# EAGLE schematic IoT_Sight (EAGLE 6.6.0)

## Sheet 1 of 3
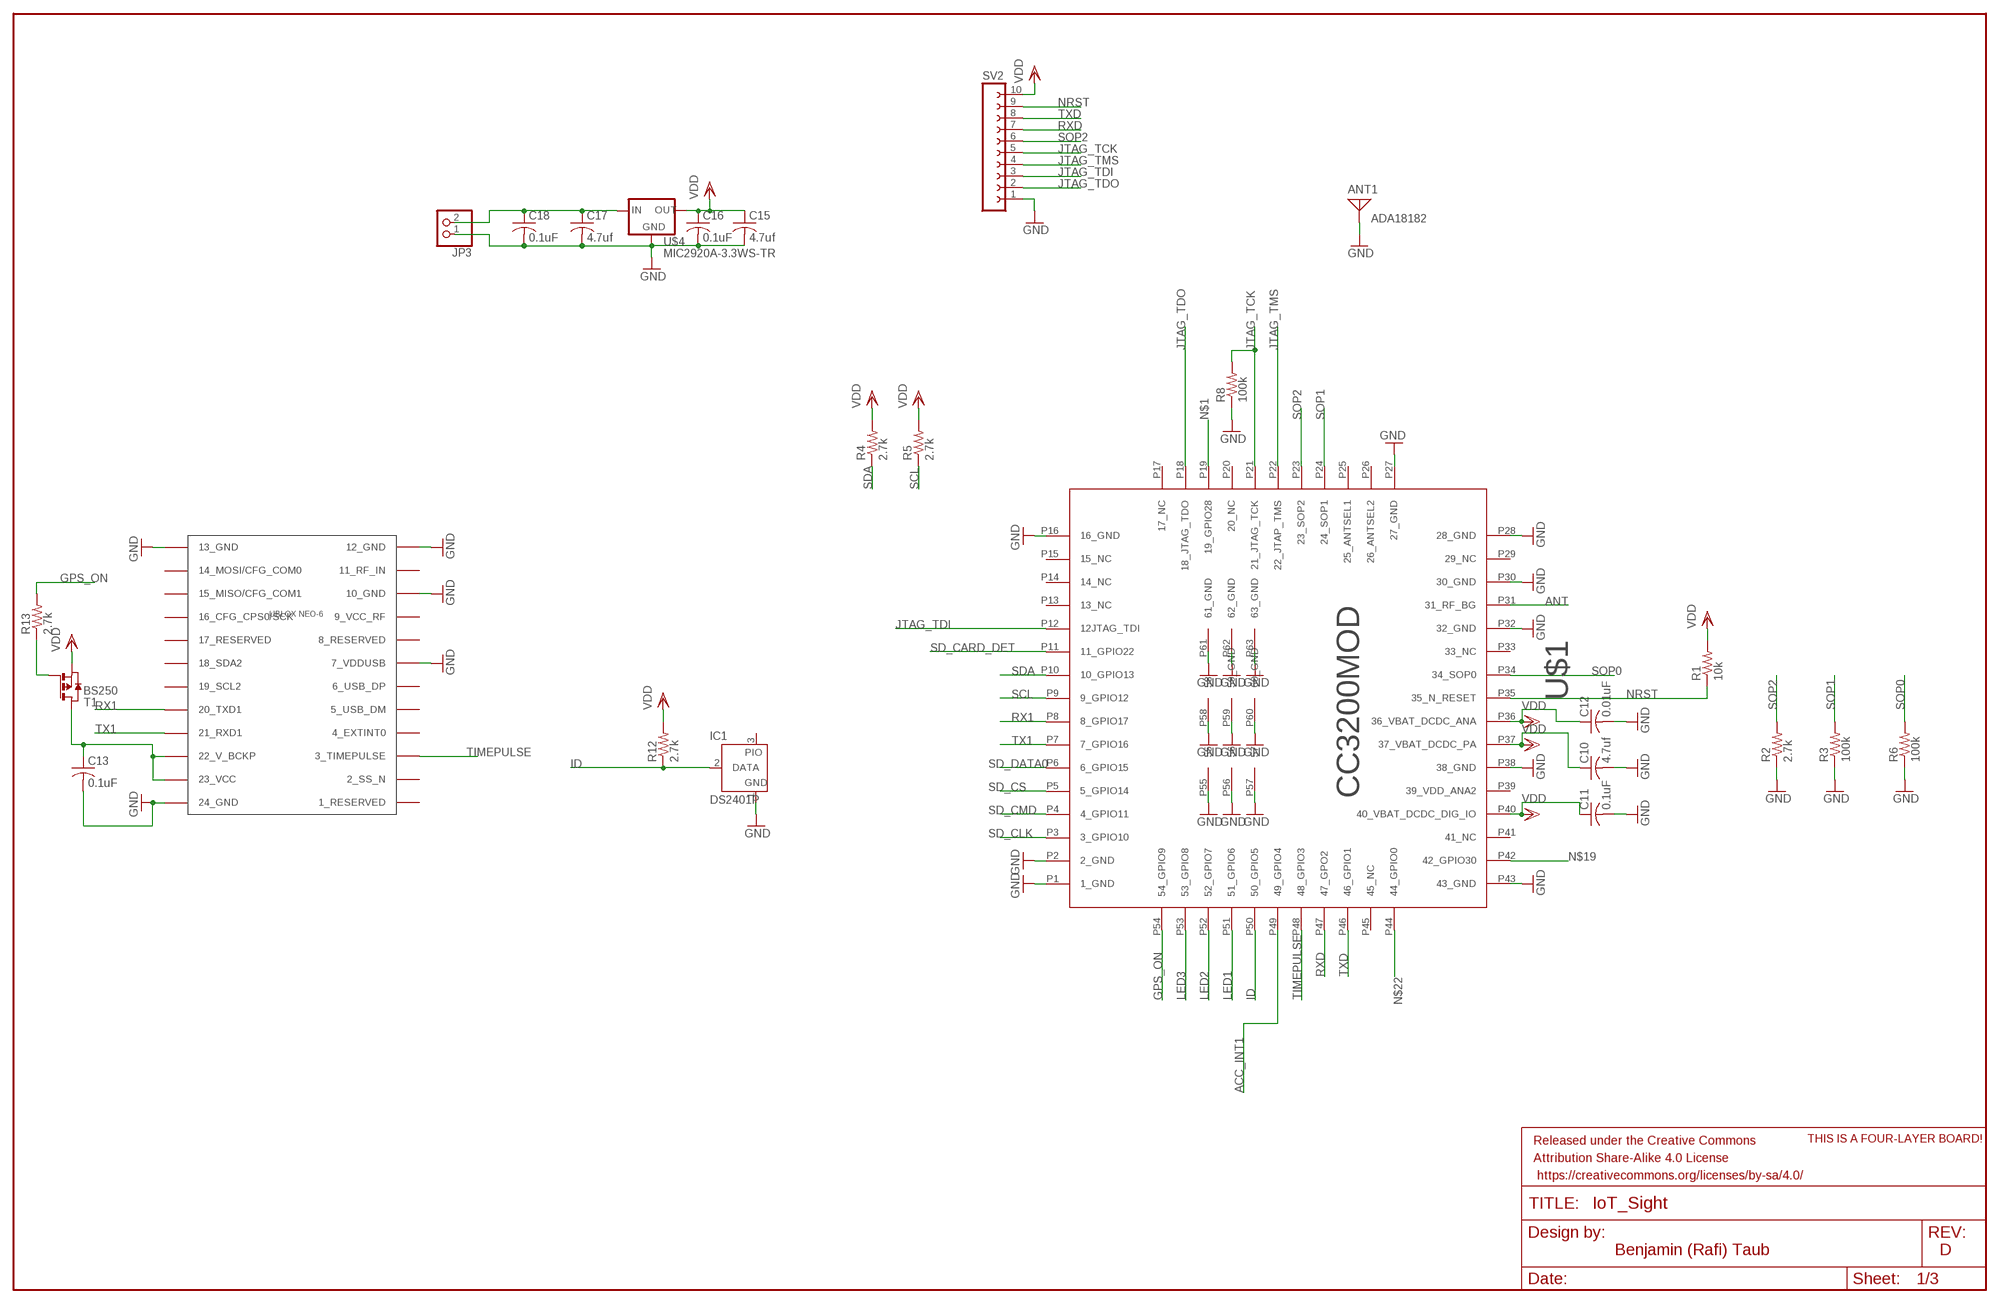
[diagram p0: schematic, sheet 1]

### Parts
ANT1  ADA18182  ANTENNA  [PAD-01]
C10  4.7uf  C-USC0805K  [C0805K]
C11  0.1uF  C-USC0805K  [C0805K]
C12  0.01uF  C-USC0805K  [C0805K]
C13  0.1uF  C-USC0805K  [C0805K]
C15  4.7uf  C-USC0805K  [C0805K]
C16  0.1uF  C-USC0805K  [C0805K]
C17  4.7uf  C-USC0805K  [C0805K]
C18  0.1uF  C-USC0805K  [C0805K]
FRAME1  FRAME-LEDGER  [CREATIVE_COMMONS]
IC1  DS2401P  DS2405P  [TSOC6]
JP3  PINHD-1X2  [1X02]
R1  10k  R-US_R0603  [R0603]
R2  2.7k  R-US_R0603  [R0603]
R3  100k  R-US_R0603  [R0603]
R4  2.7k  R-US_R0603  [R0603]
R5  2.7k  R-US_R0603  [R0603]
R6  100k  R-US_R0603  [R0603]
R8  100k  R-US_R0603  [R0603]
R12  2.7k  R-US_R0603  [R0603]
R13  2.7k  R-US_R0603  [R0603]
SV2  FE10-1  [FE10]
T1  BS250  PMOSSOT23  [SOT-23]
U$1  CC3200MOD  CC3200  [CC3200MOD]
U$2  UBLOX_NEO-7  UBLOX_NEO-6  [UBLOX_NEO-6P]
U$3  FOUR_LAYER_WARNING  [FOUR_LAYER_WARNING]
U$4  MIC2920A-3.3WS-TR  V_REG_MIC2920  [SOT223]

### Nets
ACC_INT1: U$1.P49(49_GPIO4) ; also sheet 2
ANT: U$1.P31(31_RF_BG)
GND: ANT1.1 C10.2 C11.2 C12.2 C13.2 C15.2 C16.2 C17.2 C18.2 IC1.1(GND) JP3.1 R2.1 R3.1 R6.1 R8.1 SV2.1 U$1.P1(1_GND) U$1.P2(2_GND) U$1.P16(16_GND) U$1.P27(27_GND) U$1.P28(28_GND) U$1.P30(30_GND) U$1.P32(32_GND) U$1.P38(38_GND) U$1.P43(43_GND) U$1.P55 U$1.P56 U$1.P57 U$1.P58 U$1.P59(59_GND) U$1.P60(60_GND) U$1.P61(61_GND) U$1.P62(62_GND) U$1.P63(63_GND) U$2.7_VDDUSB U$2.10_GND U$2.12_GND U$2.13_GND U$2.24_GND U$4.2(GND) ; also sheet 2,3
GPS_ON: R13.2 U$1.P54(54_GPIO9)
ID: IC1.2(DATA) R12.1 U$1.P50(50_GPIO5)
JTAG_TCK: R8.2 SV2.5 U$1.P21(21_JTAG_TCK)
JTAG_TDI: SV2.3 U$1.P12(12JTAG_TDI)
JTAG_TDO: SV2.2 U$1.P18(18_JTAG_TDO)
JTAG_TMS: SV2.4 U$1.P22(22_JTAP_TMS)
LED1: U$1.P51(51_GPIO6) ; also sheet 3
LED2: U$1.P52(52_GPIO7) ; also sheet 3
LED3: U$1.P53(53_GPIO8) ; also sheet 3
N$1: U$1.P19(19_GPIO28)
N$17: C17.1 C18.1 JP3.2 U$4.1(IN)
N$18: C13.1 T1.1(D) U$2.22_V_BCKP U$2.23_VCC
N$19: U$1.P42(42_GPIO30)
N$20: R13.1 T1.3(G)
N$22: U$1.P44(44_GPIO0)
NRST: R1.1 SV2.9 U$1.P35(35_N_RESET)
RX1: U$1.P8(8_GPIO17) U$2.20_TXD1
RXD: SV2.7 U$1.P47(47_GPO2)
SCL: R5.1 U$1.P9(9_GPIO12) ; also sheet 2
SD_CARD_DET: U$1.P11(11_GPIO22) ; also sheet 2
SD_CLK: U$1.P3(3_GPIO10) ; also sheet 2
SD_CMD: U$1.P4(4_GPIO11) ; also sheet 2
SD_CS: U$1.P5(5_GPIO14) ; also sheet 2
SD_DATA0: U$1.P6(6_GPIO15) ; also sheet 2
SDA: R4.1 U$1.P10(10_GPIO13) ; also sheet 2
SOP0: R6.2 U$1.P34(34_SOP0)
SOP1: R3.2 U$1.P24(24_SOP1)
SOP2: R2.2 SV2.6 U$1.P23(23_SOP2)
TIMEPULSE: U$1.P48(48_GPIO3) U$2.3_TIMEPULSE
TX1: U$1.P7(7_GPIO16) U$2.21_RXD1
TXD: SV2.8 U$1.P46(46_GPIO1)
VDD: C10.1 C11.1 C12.1 C15.1 C16.1 R1.2 R4.2 R5.2 R12.2 SV2.10 T1.2(S) U$1.P36(36_VBAT_DCDC_ANA) U$1.P37(37_VBAT_DCDC_PA) U$1.P40(40_VBAT_DCDC_DIG_IO) U$4.3(OUT) ; also sheet 2
Unconnected: IC1.3(PIO) U$1.P13(13_NC) U$1.P14(14_NC) U$1.P15(15_NC) U$1.P17(17_NC) U$1.P20(20_NC) U$1.P25(25_ANTSEL1) U$1.P26(26_ANTSEL2) U$1.P29(29_NC) U$1.P33(33_NC) U$1.P39(39_VDD_ANA2) U$1.P41(41_NC) U$1.P45(45_NC) U$2.1_RESERVED U$2.2_SS_N U$2.4_EXTINT0 U$2.5_USB_DM U$2.6_USB_DP U$2.8_RESERVED U$2.9_VCC_RF U$2.11_RF_IN U$2.14_MOSI/CFG_COM0 U$2.15_MISO/CFG_COM1 U$2.16_CFG_CPS0/SCK U$2.17_RESERVED U$2.18_SDA2 U$2.19_SCL2

### Notes on the sheet
- Benjamin (Rafi) Taub | D

## Sheet 2 of 3
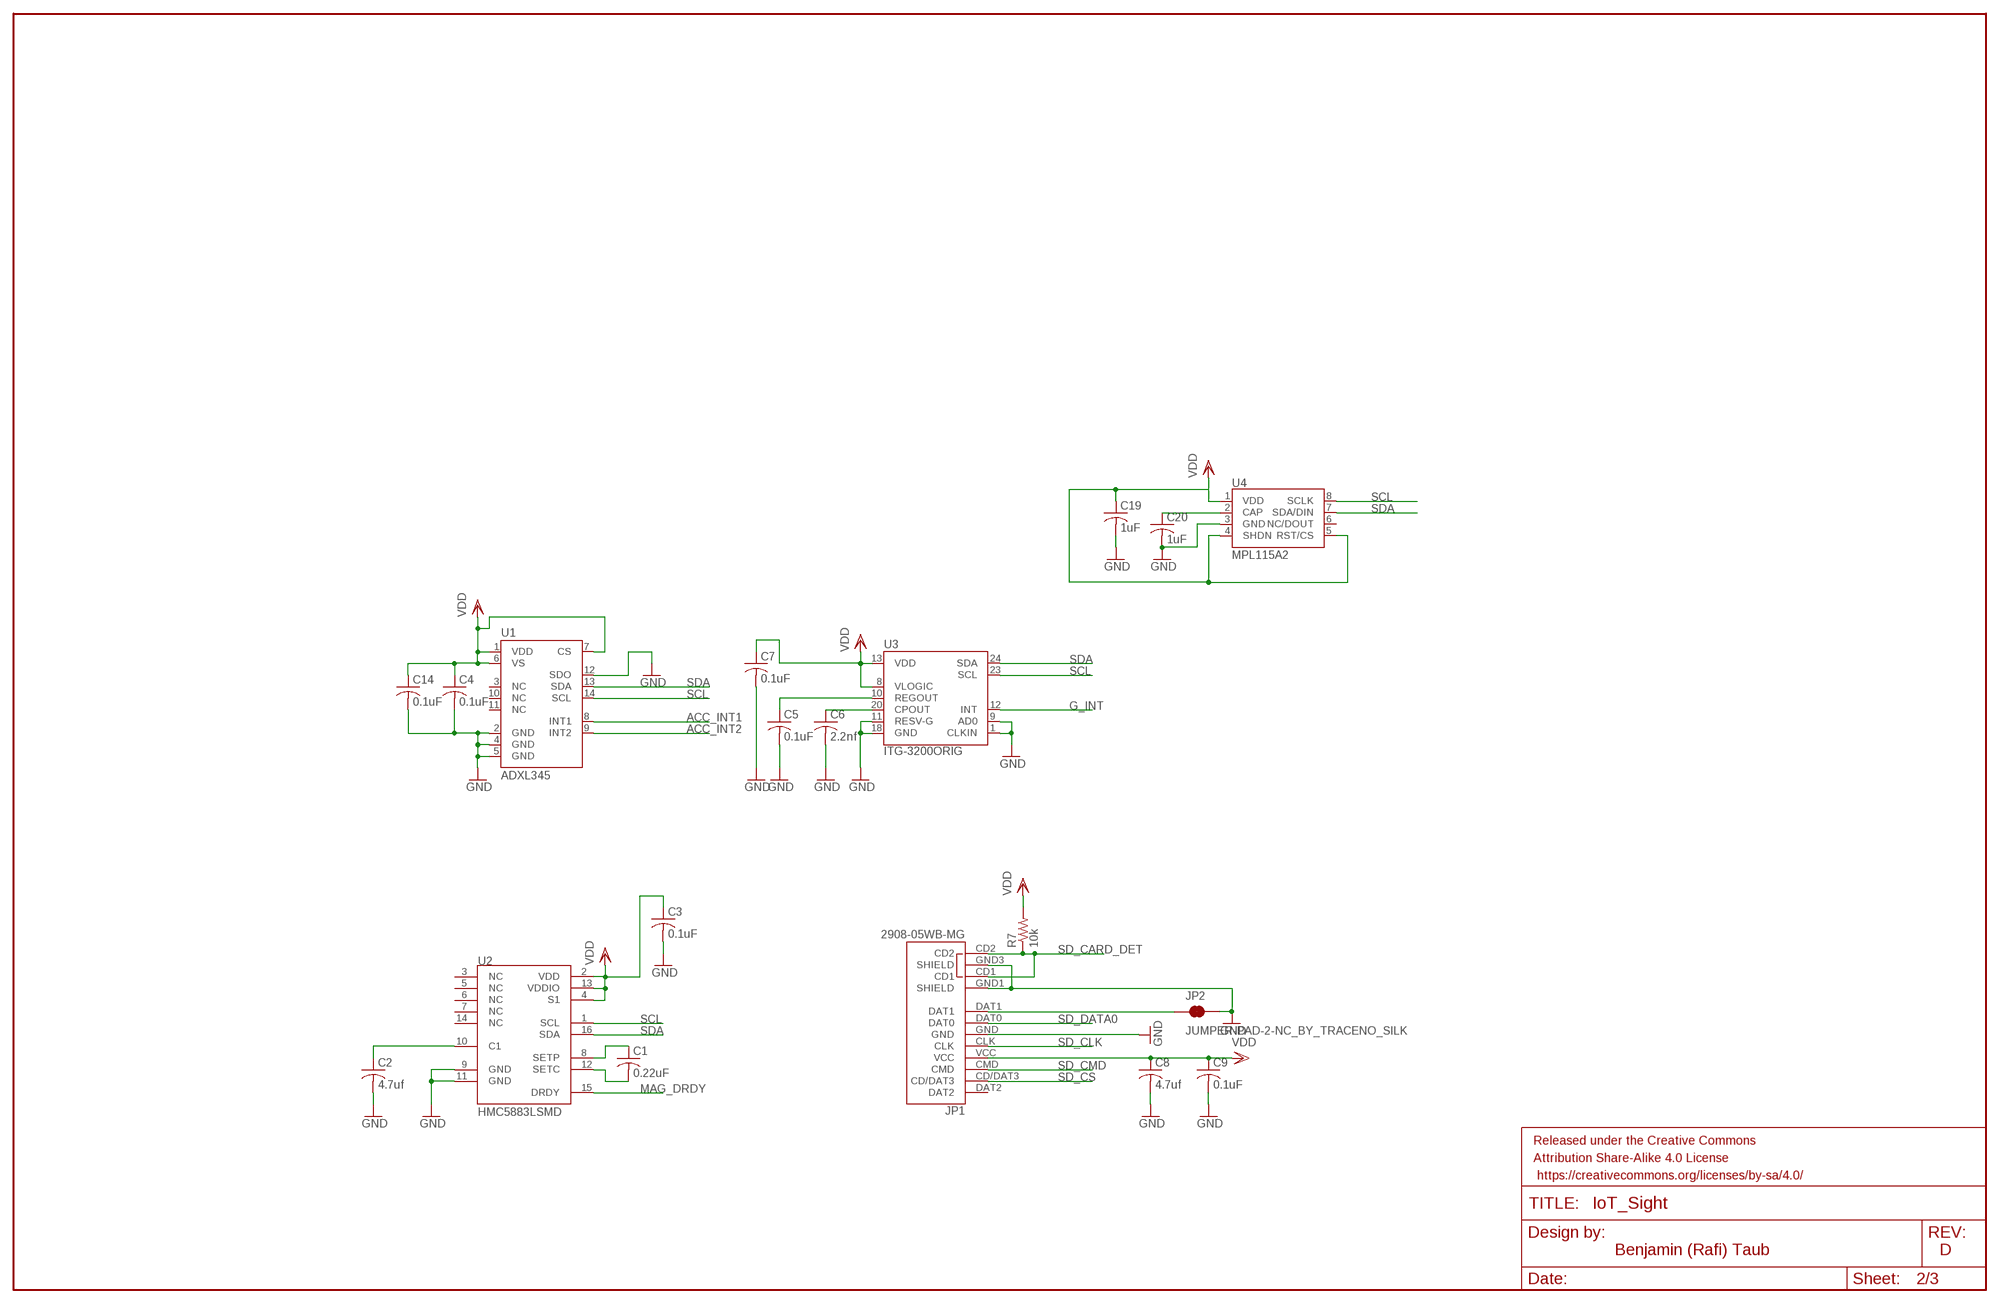
[diagram p1: schematic, sheet 2]

### Parts
C1  0.22uF  C-USC0805K  [C0805K]
C2  4.7uf  C-USC0805K  [C0805K]
C3  0.1uF  C-USC0805K  [C0805K]
C4  0.1uF  C-USC0805K  [C0805K]
C5  0.1uF  C-USC0805K  [C0805K]
C6  2.2nf  C-USC0805K  [C0805K]
C7  0.1uF  C-USC0805K  [C0805K]
C8  4.7uf  C-USC0805K  [C0805K]
C9  0.1uF  C-USC0805K  [C0805K]
C14  0.1uF  C-USC0805K  [C0805K]
C19  1uF  C-USC0805K  [C0805K]
C20  1uF  C-USC0805K  [C0805K]
FRAME2  FRAME-LEDGER  [CREATIVE_COMMONS]
JP1  2908-05WB-MG  USD-SDIO-SOCKET  [MICRO-SD-SOCKET-SDIO]
JP2  JUMPER-PAD-2-NC_BY_TRACENO_SILK  [PAD-JUMPER-2-NC_BY_TRACE_NO_SILK]
R7  10k  R-US_R0603  [R0603]
U1  ADXL345  [LGA14]
U2  HMC5883LSMD  [16LPCC]
U3  ITG-3200ORIG  [QFN-24]
U4  MPL115A2  MPL115A  [LGA8]

### Nets
ACC_INT1: U1.8(INT1) ; also sheet 1
ACC_INT2: U1.9(INT2)
G_INT: U3.12(INT)
GND: C2.2 C3.2 C4.2 C5.2 C6.2 C7.2 C8.2 C9.2 C14.2 C19.2 C20.2 JP1.GND JP1.GND1(SHIELD) JP1.GND3(SHIELD) JP2.2 U1.2(GND) U1.4(GND) U1.5(GND) U1.12(SDO) U2.9(GND) U2.11(GND) U3.1(CLKIN) U3.9(AD0) U3.11(RESV-G) U3.18(GND) U4.3(GND) ; also sheet 1,3
MAG_DRDY: U2.15(DRDY)
N$7: JP1.DAT1 JP2.1
N$8: C1.2 U2.12(SETC)
N$9: C1.1 U2.8(SETP)
N$10: C2.1 U2.10(C1)
N$13: C5.1 U3.10(REGOUT)
N$15: C6.1 U3.20(CPOUT)
N$23: C20.1 U4.2(CAP)
SCL: U1.14(SCL) U2.1(SCL) U3.23(SCL) U4.8(SCLK) ; also sheet 1
SD_CARD_DET: JP1.CD1 JP1.CD2 R7.1 ; also sheet 1
SD_CLK: JP1.CLK ; also sheet 1
SD_CMD: JP1.CMD ; also sheet 1
SD_CS: JP1.CD/DAT3 ; also sheet 1
SD_DATA0: JP1.DAT0 ; also sheet 1
SDA: U1.13(SDA) U2.16(SDA) U3.24(SDA) U4.7(SDA/DIN) ; also sheet 1
VDD: C3.1 C4.1 C7.1 C8.1 C9.1 C14.1 C19.1 JP1.VCC R7.2 U1.1(VDD) U1.6(VS) U1.7(CS) U2.2(VDD) U2.4(S1) U2.13(VDDIO) U3.8(VLOGIC) U3.13(VDD) U4.1(VDD) U4.4(SHDN) U4.5(RST/CS) ; also sheet 1
Unconnected: JP1.DAT2 U1.3(NC) U1.10(NC) U1.11(NC) U2.3(NC) U2.5(NC) U2.6(NC) U2.7(NC) U2.14(NC) U4.6(NC/DOUT)

### Notes on the sheet
- Benjamin (Rafi) Taub | D

## Sheet 3 of 3
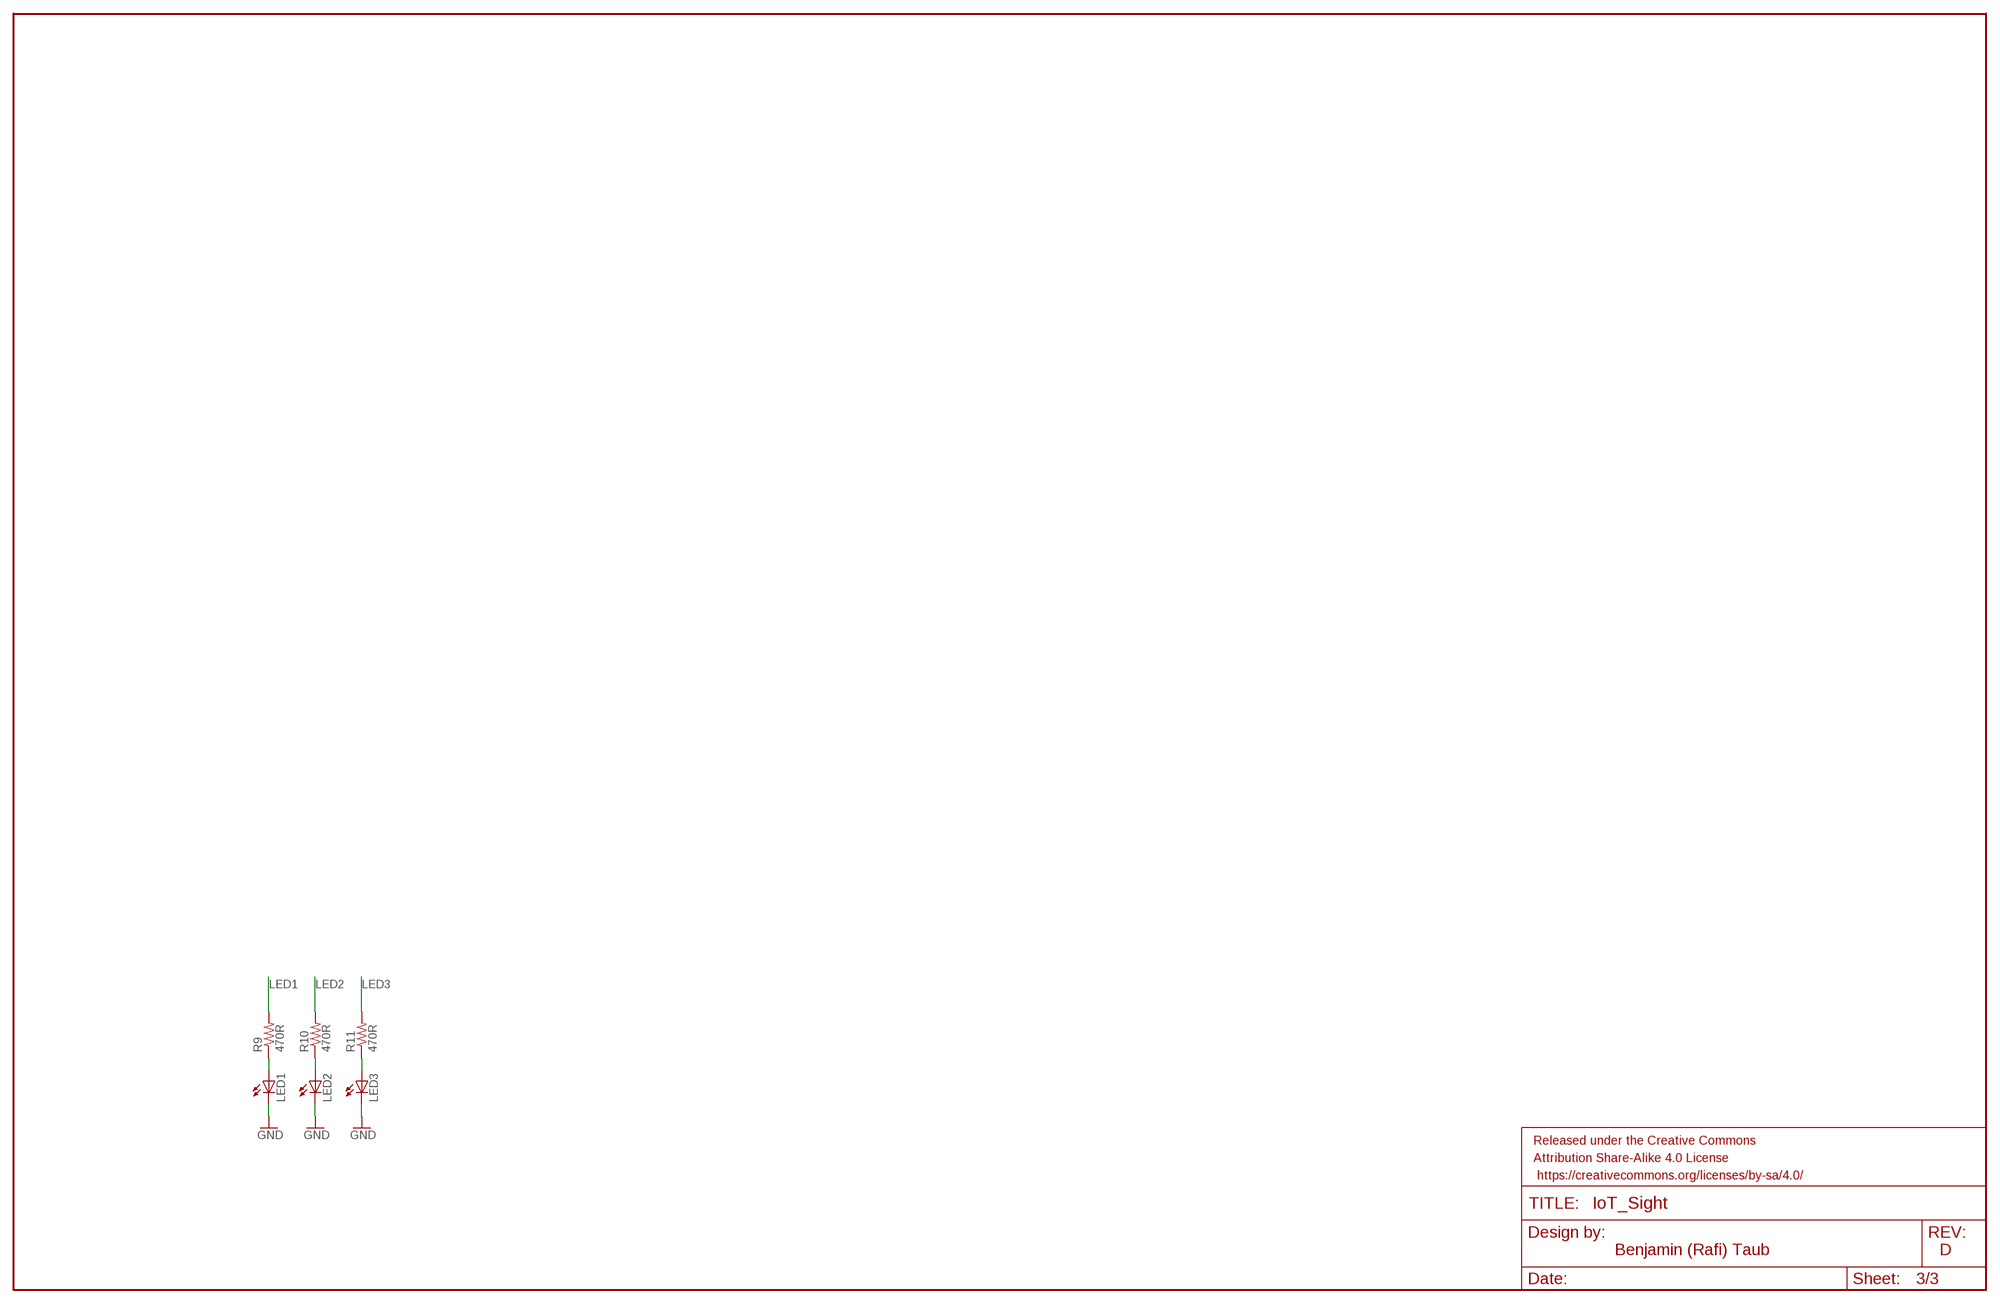
[diagram p2: schematic, sheet 3]

### Parts
FRAME3  FRAME-LEDGER  [CREATIVE_COMMONS]
LED1  LEDCHIPLED_0805  [CHIPLED_0805]
LED2  LEDCHIPLED_0805  [CHIPLED_0805]
LED3  LEDCHIPLED_0805  [CHIPLED_0805]
R9  470R  R-US_R0603  [R0603]
R10  470R  R-US_R0603  [R0603]
R11  470R  R-US_R0603  [R0603]

### Nets
GND: LED1.C LED2.C LED3.C ; also sheet 1,2
LED1: R9.2 ; also sheet 1
LED2: R10.2 ; also sheet 1
LED3: R11.2 ; also sheet 1
N$11: LED1.A R9.1
N$12: LED2.A R10.1
N$14: LED3.A R11.1

### Notes on the sheet
- Benjamin (Rafi) Taub | D

## Library data of the parts
ANT1 = discrete:ANTENNA: Antenna
C1-C20 = rcl:C-US: CAPACITOR, American symbol
FRAME1-FRAME3 = SparkFun-Aesthetics:FRAME-LEDGER: Schematic Frame Standard 11x14 US Ledger frame
IC1 = maxim:DS2405: Addressable Switch DALLAS Semiconductor; OC_FARNELL: unknown; OC_NEWARK: unknown
JP1 = SparkFun-Connectors:USD-SDIO-SOCKET: microSD Socket Push-push type uSD socket with full SDIO signal mapping. Spark Fun Electronics SKU : PRT-00127. tDoc lines correctly indicate media card edge positions when inserting (unlocked, locked, depressed). NOTE: CD1 and CD2 are connected internally, and short to ground when card is removed.; PROD_ID: CONN-07820
JP2 = SparkFun-Passives:JUMPER-PAD-2-NC_BY_TRACE
JP3 = pinhead:PINHD-1X2: PIN HEADER
LED1-LED3 = led:LED: LED OSRAM: - CHIPLED LG R971, LG N971, LY N971, LG Q971, LY Q971, LO R971, LY R971 LH N974, LH R974 LS Q976, LO Q976, LY Q976 LO Q996 - Hyper CHIPLED LW Q18S LB Q993, LB Q99A, LB R99A - SideLED LS A670, LO A670, LY A670, LG A670, LP A670 LB A673, LV A673, LT A673, LW A673 LH A674 LY A675 LS A676, LA A676, LO A676, LY A676, LW A676 LS A679, LY A679, LG A679 - Hyper Micro SIDELED® LS Y876, LA Y876, LO Y876, LY Y876 LT Y87S - SmartLED LW L88C, LW L88S LB L89C, LB L89S, LG L890 LS L89K, LO L89K, LY L89K LS L896, LA L896, LO L896, LY L896 - TOPLED LS T670, LO T670, LY T670, LG T670, LP T670 LSG T670, LSP T670, LSY T670, LOP T670, LYG T670 LG T671, LOG T671, LSG T671 LB T673, LV T673, LT T673, LW T673 LH T674 LS T676, LA T676, LO T676, LY T676, LB T676, LH T676, LSB T676, LW T676 LB T67C, LV T67C, LT T67C, LS T67K, LO T67K, LY T67K, LW E67C LS E67B, LA E67B, LO E67B, LY E67B, LB E67C, LV E67C, LT E67C LW T67C LS T679, LY T679, LG T679 LS T770, LO T770, LY T770, LG T770, LP T770 LB T773, LV T773, LT T773, LW T773 LH T774 LS E675, LA E675, LY E675, LS T675 LS T776, LA T776, LO T776, LY T776, LB T776 LHGB T686 LT T68C, LB T68C - Hyper Mini TOPLED® LB M676 - Mini TOPLED Santana® LG M470 LS M47K, LO M47K, LY M47K Source: http://www.osram.convergy.de LUXEON: - LUMILED® LXK2-PW12-R00, LXK2-PW12-S00, LXK2-PW14-U00, LXK2-PW14-V00 LXK2-PM12-R00, LXK2-PM12-S00, LXK2-PM14-U00 LXK2-PE12-Q00, LXK2-PE12-R00, LXK2-PE12-S00, LXK2-PE14-T00, LXK2-PE14-U00 LXK2-PB12-K00, LXK2-PB12-L00, LXK2-PB12-M00, LXK2-PB14-N00, LXK2-PB14-P00, LXK2-PB14-Q00 LXK2-PR12-L00, LXK2-PR12-M00, LXK2-PR14-Q00, LXK2-PR14-R00 LXK2-PD12-Q00, LXK2-PD12-R00, LXK2-PD12-S00 LXK2-PH12-R00, LXK2-PH12-S00 LXK2-PL12-P00, LXK2-PL12-Q00, LXK2-PL12-R00 Source: www.luxeon.com KINGBRIGHT: KA-3528ASYC Source: www.kingbright.com
R1-R13 = rcl:R-US_: RESISTOR, American symbol
SV2 = con-lsta:FE10-1: FEMALE HEADER; OC_FARNELL: unknown; OC_NEWARK: unknown
T1 = zetex:PMOSSOT23: MOS FET; OC_FARNELL: unknown; OC_NEWARK: unknown
U1 = SparkFun-Sensors:ADXL345: 3-axis SPI/I2C 2/4/8/16g accelerometer
U2 = SparkFun-Sensors:HMC5883L: 3 Axis Digital Compass IC; PROD_ID: IC-10284
U3 = SparkFun-DigitalIC:ITG-3200: ITG-3200 3-axis gyro, digital output, qfn24 package
U4 = SparkFun-Sensors:MPL115A: MPL115A1 (SPI) and MPL115A2 (I2C) Miniature Digital Barometer 5.0x3.0x1.2mm LGA Package
U$1 = cc3200mod:CC3200
U$2 = Ava:UBLOX_NEO-6: UBLOX NEO-6 GPS MODULE Author Anthony Stirk / http://ava.upuaut.net http://www.u-blox.com/images/downloads/Product_Docs/LEA-6_NEO-6_MAX_HardwareIntegrationManual_%28GPS.G6-HW-09007%29.pdf http://www.u-blox.com/images/downloads/Product_Docs/NEO-6_DataSheet_%28GPS.G6-HW-09005%29.pdf
U$3 = SparkFun-Aesthetics:FOUR_LAYER_WARNING: Warning text which will appear on both the schematic and the board file, notifying viewers that the design is a four-layer PCB.
U$4 = SparkFun-PowerIC:V_REG_MIC2920: MIC2920A (http://www.micrel.com/_PDF/mic2920.pdf) - 400mA output LDO Regulator